# Altium project FMC_ADC_100M_10B_16CHA_TDC.PrjPCB (part 3 of 5)

## Sheet power_supply.SchDoc: FMC_ADC
size 420 x 297 mm; Author: G.Kasprowicz; CompanyName: WUT ISE; DrawnBy: G.Kasprowicz; Organization: WUT ISE; Address1: PW ISE; Address2: Nowowiejska 15/19 00-665 Warsaw; Address3: gkasprow@gmail.com; Revision: 2; SheetNumber: -; SheetTotal: -; ModifiedBy: -; CheckedDate: -; Title2: Power supply; DivGrp: WUT ISE; Designer: G.Kasprowicz; ModifiedDate: -; ProjectName: Sensor Box
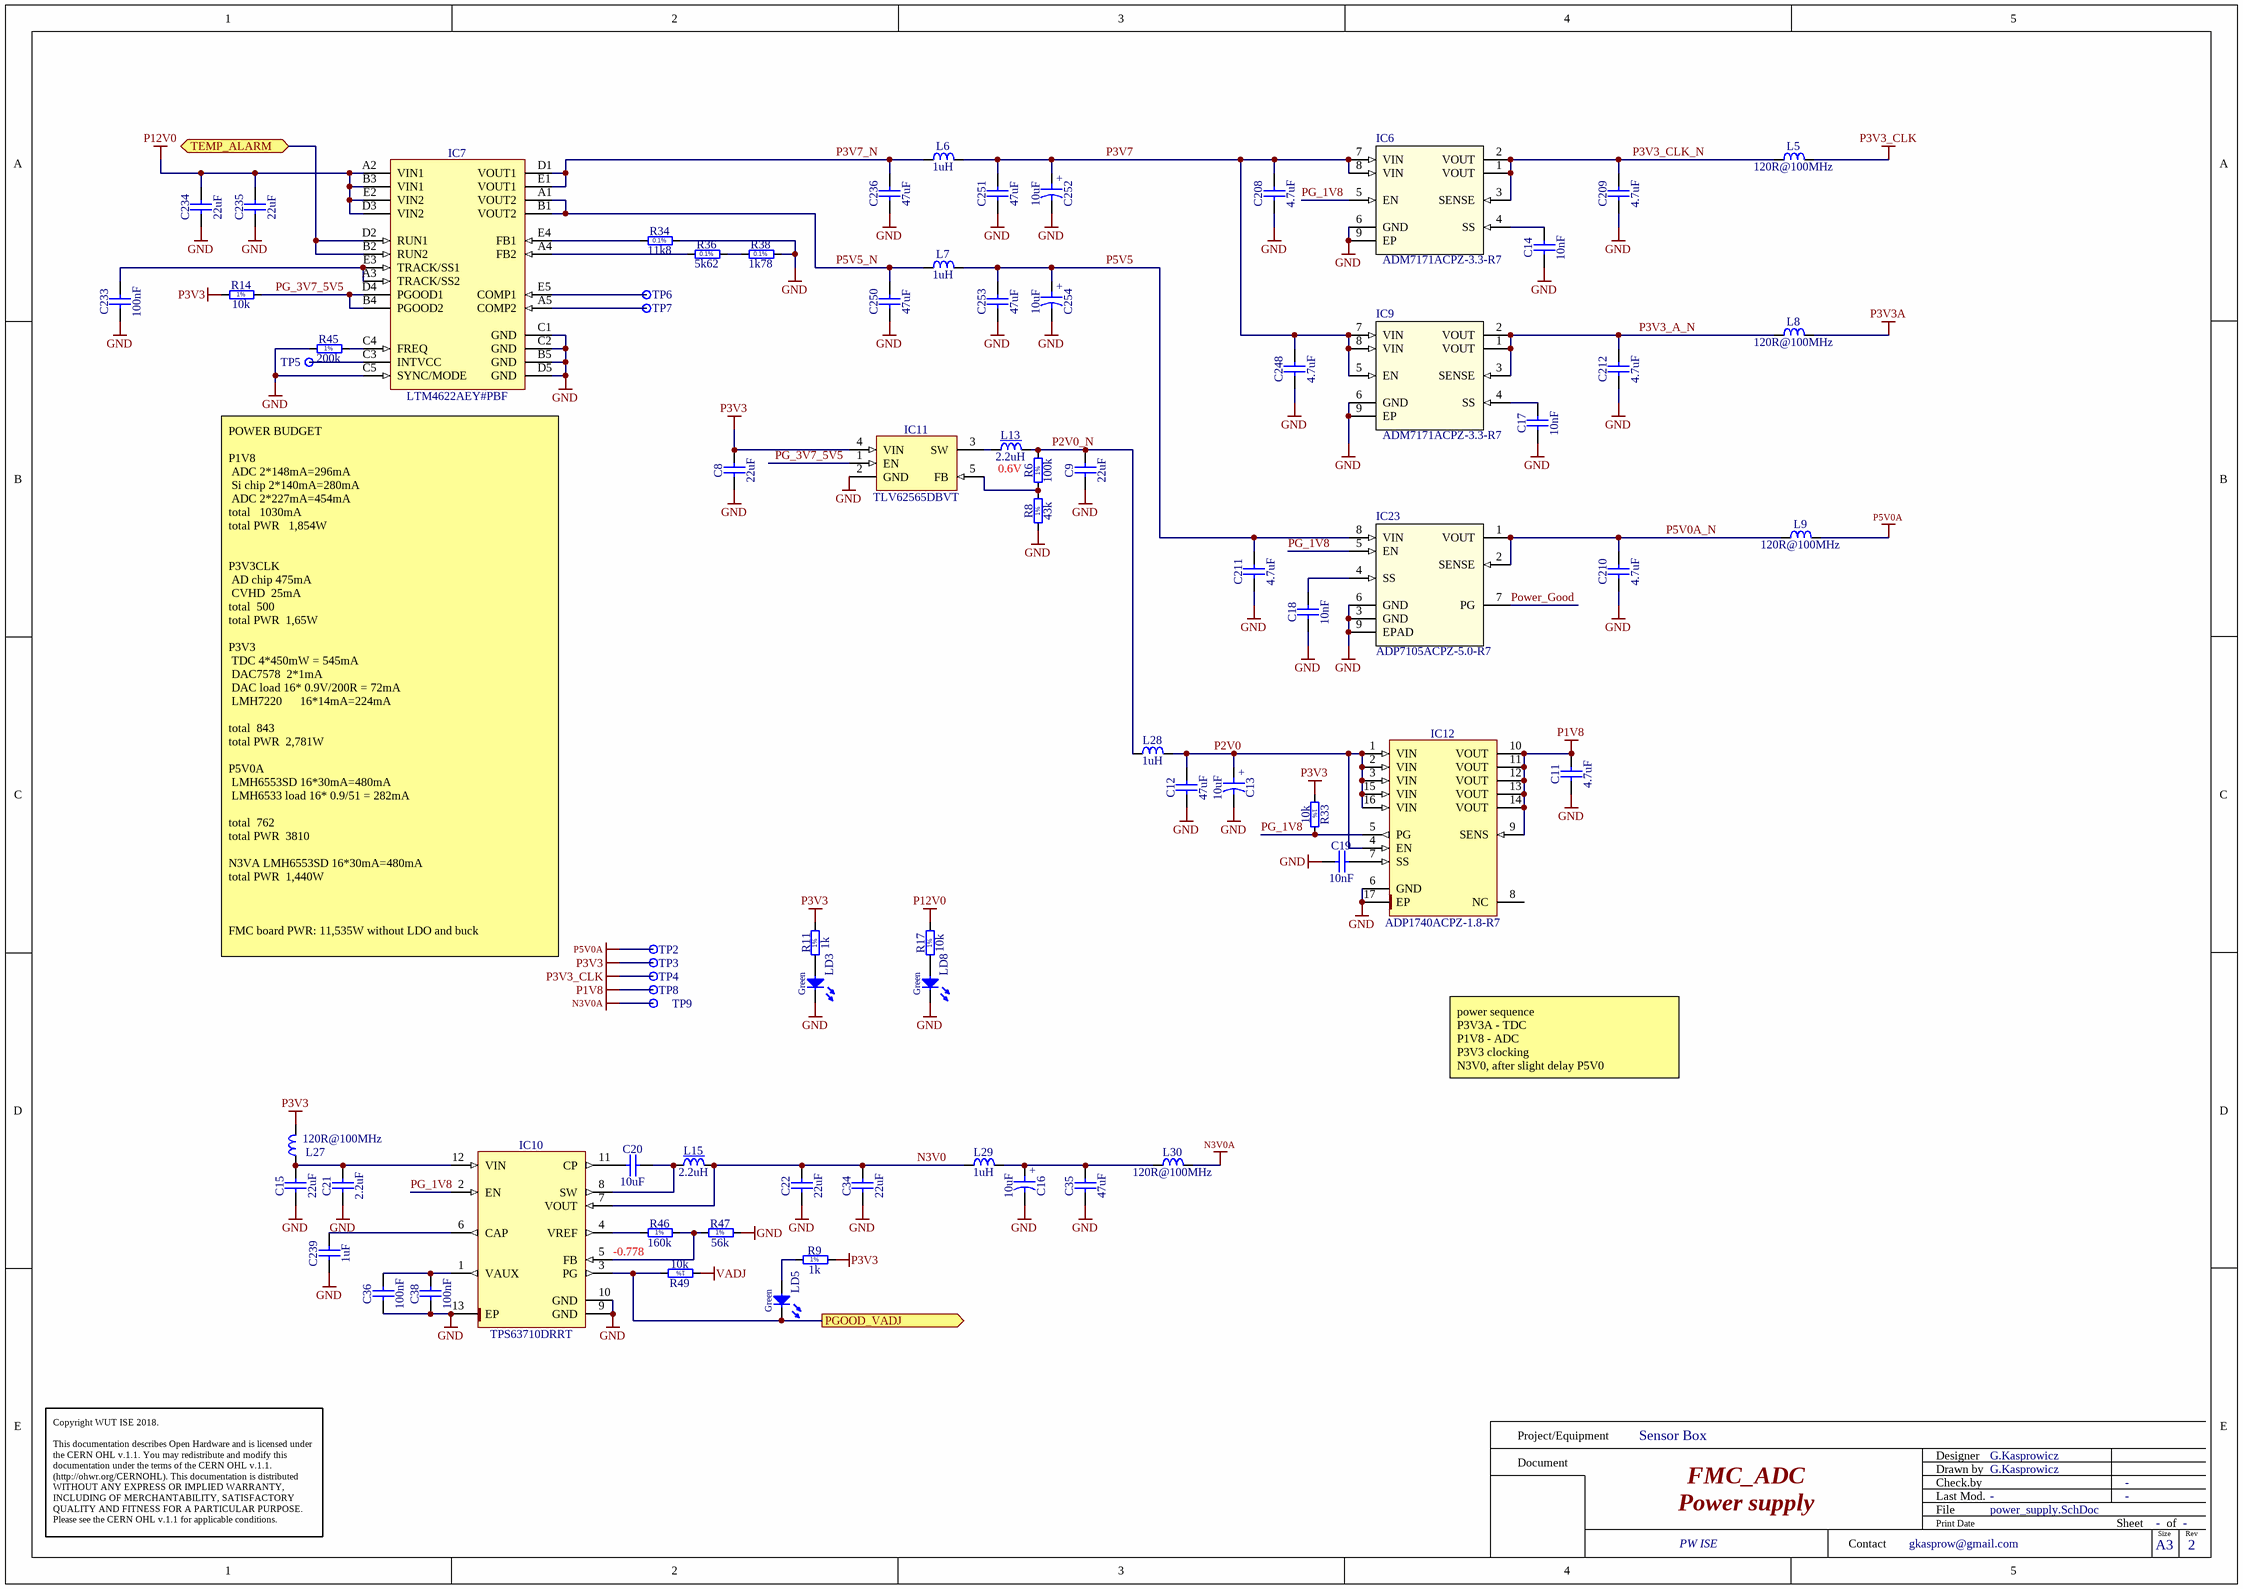
[diagram p6: power_supply.SchDoc]

### Parts
C8  22uF  [CAPC2012X135N]
C9  22uF  [CAPC2012X135N]
C11  4.7uF  [CAPC1709X95N]
C12  47uF  [CAPC3225X270N]
C13  10uF  [CAPMP3216X180N]
C14  10nF  [CAPC1005X55N]
C15  22uF  [CAPC2012X135N]
C16  10uF  [CAPMP3216X180N]
C17  10nF  [CAPC1005X55N]
C18  10nF  [CAPC1005X55N]
C19  10nF  [CAPC1005X55N]
C20  10uF  [CAPC2012X135N]
C21  2.2uF  [CAPC1608X87N]
C22  22uF  [CAPC2012X135N]
C34  22uF  [CAPC2012X135N]
C35  47uF  [CAPC3225X270N]
C36  100nF  [CAPC1005X55N]
C38  100nF  [CAPC1005X55N]
C208  4.7uF  [CAPC1709X95N]
C209  4.7uF  [CAPC1709X95N]
C210  4.7uF  [CAPC1709X95N]
C211  4.7uF  [CAPC1709X95N]
C212  4.7uF  [CAPC1709X95N]
C233  100nF  [CAPC1005X55N]
C234  22uF  [CAPC2012X135N]
C235  22uF  [CAPC2012X135N]
C236  47uF  [CAPC3225X270N]
C239  1uF  [CAPC1608X87N]
C248  4.7uF  [CAPC1709X95N]
C250  47uF  [CAPC3225X270N]
C251  47uF  [CAPC3225X270N]
C252  10uF  [CAPMP3216X180N]
C253  47uF  [CAPC3225X270N]
C254  10uF  [CAPMP3216X180N]
IC6  ADM7171ACPZ-3.3-R7  [CP_8_21-L]
IC7  LTM4622AEY#PBF  [BGA25C127P5X5_625X625X262]
IC9  ADM7171ACPZ-3.3-R7  [CP_8_21-L]
IC10  TPS63710DRRT  [SON50P300X80_HS-13N]
IC11  TLV62565DBVT  [SOT95P280X145-5N]
IC12  ADP1740ACPZ-1.8-R7  [QFN65P400X400X100-17N-S225]
IC23  ADP7105ACPZ-5.0-R7  [CP_8_5]
L5  120R@100MHz  [INDC1608X65N]
L6  1uH  [INDC2620X100N]
L7  1uH  [INDC2620X100N]
L8  120R@100MHz  [INDC1608X65N]
L9  120R@100MHz  [INDC1608X65N]
L13  2.2uH  [IND_WURTH_WE-TPC_4828]
L15  2.2uH  [IND_WURTH_WE-TPC_4828]
L27  120R@100MHz  [INDC1608X65N]
L28  1uH  [INDC2620X100N]
L29  1uH  [INDC2620X100N]
L30  120R@100MHz  [INDC1608X65N]
LD3  Green  [LED_KINGBRIGHT_KPH-1608CGCK]
LD5  Green  [LED_KINGBRIGHT_KPH-1608CGCK]
LD8  Green  [LED_KINGBRIGHT_KPH-1608CGCK]
R6  100k  [RESC1005X40N]
R8  43k  [RESC1005X40N]
R9  1k  [RESC1005X40N]
R11  1k  [RESC1005X40N]
R14  10k  [RESC1005X40N]
R17  10k  [RESC1005X40N]
R33  10k  [RESC1005X40N]
R34  11k8  [RESC1608X55N]
R36  5k62  [RESC1608X55N]
R38  1k78  [RESC1608X55N]
R45  200k  [RESC1005X40N]
R46  160k  [RESC1005X40N]
R47  56k  [RESC1005X40N]
R49  10k  [RESC1005X40N]
TP2  Test Point  [TPS62]  (value not drawn)
TP3  Test Point  [TPS62]  (value not drawn)
TP4  Test Point  [TPS62]  (value not drawn)
TP5  Test Point  [TPS62]  (value not drawn)
TP6  Test Point  [TPS62]  (value not drawn)
TP7  Test Point  [TPS62]  (value not drawn)
TP8  Test Point  [TPS62]  (value not drawn)
TP9  Test Point  [TPS62]  (value not drawn)

### Ports
PGOOD_VADJ (out), TEMP_ALARM (bidir)

### Nets
GND: C8.1 C9.1 C11.1 C12.1 C13.2 C14.1 C15.1 C16.2 C17.1 C18.1 C19.1 C21.1 C22.1 C34.1 C35.1 C36.1 C38.1 C208.1 C209.1 C210.1 C211.1 C212.1 C233.1 C234.1 C235.1 C236.1 C239.1 C248.1 C250.1 C251.1 C252.2 C253.1 C254.2 IC6.6(GND) IC6.9(EP) IC7.B5(GND) IC7.C1(GND) IC7.C2(GND) IC7.C5(SYNC/MODE) IC7.D5(GND) IC9.6(GND) IC9.9(EP) IC10.9(GND) IC10.10(GND) IC10.13(EP) IC11.2(GND) IC12.6(GND) IC12.17(EP) IC23.3(GND) IC23.6(GND) IC23.9(EPAD) LD3.1(C) LD8.1(C) R8.1 R34.2 R38.2 R45.1 R47.2
N3V0A: L30.2 TP9.1
P1V8: C11.2 IC12.9(SENS) IC12.10(VOUT) IC12.11(VOUT) IC12.12(VOUT) IC12.13(VOUT) IC12.14(VOUT) TP8.1
P3V3: C8.2 IC11.4(VIN) L27.2 R9.2 R11.2 R14.1 R33.1 TP3.1
P3V3_CLK: L5.2 TP4.1
P3V3A: L8.2  [project net DVDD33]
P5V0A: L9.2 TP2.1
P12V0: C234.2 C235.2 IC7.A2(VIN1) IC7.B3(VIN1) IC7.D3(VIN2) IC7.E2(VIN2) R17.2
VADJ: R49.1
LA29_N: IC10.3(PG) LD5.1(C) R49.2 ; port PGOOD_VADJ
N3V0: C22.2 C34.2 IC10.7(VOUT) L15.2 L29.1
P2V0: C12.2 C13.1 IC12.1(VIN) IC12.2(VIN) IC12.3(VIN) IC12.4(EN) IC12.15(VIN) IC12.16(VIN) L28.2
P2V0_N: C9.2 L13.2 L28.1 R6.2
P3V3_A_N: C212.2 IC9.1(VOUT) IC9.2(VOUT) IC9.3(SENSE) L8.1
P3V3_CLK_N: C209.2 IC6.1(VOUT) IC6.2(VOUT) IC6.3(SENSE) L5.1
P3V7: C208.2 C248.2 C251.2 C252.1 IC6.7(VIN) IC6.8(VIN) IC9.5(EN) IC9.7(VIN) IC9.8(VIN) L6.2
P3V7_N: C236.2 IC7.D1(VOUT1) IC7.E1(VOUT1) L6.1
P5V0A_N: C210.2 IC23.1(VOUT) IC23.2(SENSE) L9.1
P5V5: C211.2 C253.2 C254.1 IC23.8(VIN) L7.2
P5V5_N: C250.2 IC7.A1(VOUT2) IC7.B1(VOUT2) L7.1
PG_1V8: IC6.5(EN) IC10.2(EN) IC12.5(PG) IC23.5(EN) R33.2
PG_3V7_5V5: IC7.B4(PGOOD2) IC7.D4(PGOOD1) IC11.1(EN) R14.2
Power_Good: IC23.7(PG)
TEMP_ALARM: IC7.B2(RUN2) IC7.D2(RUN1) ; port TEMP_ALARM
NetC14_2: C14.2 IC6.4(SS)
NetC15_2: C15.2 C21.2 IC10.12(VIN) L27.1
NetC16_1: C16.1 C35.2 L29.2 L30.1
NetC17_2: C17.2 IC9.4(SS)
NetC18_2: C18.2 IC23.4(SS)
NetC19_2: C19.2 IC12.7(SS)
NetC20_1: C20.1 IC10.11(CP)
NetC20_2: C20.2 IC10.8(SW) L15.1
NetC36_2: C36.2 C38.2 IC10.1(VAUX)
NetC233_2: C233.2 IC7.A3(TRACK/SS2) IC7.E3(TRACK/SS1)
NetC239_2: C239.2 IC10.6(CAP)
NetIC7_A4: IC7.A4(FB2) R36.1
NetIC7_A5: IC7.A5(COMP2) TP7.1
NetIC7_C3: IC7.C3(INTVCC) TP5.1
NetIC7_C4: IC7.C4(FREQ) R45.2
NetIC7_E4: IC7.E4(FB1) R34.1
NetIC7_E5: IC7.E5(COMP1) TP6.1
NetIC10_4: IC10.4(VREF) R46.1
NetIC10_5: IC10.5(FB) R46.2 R47.1
NetIC11_3: IC11.3(SW) L13.1
NetIC11_5: IC11.5(FB) R6.1 R8.2
NetLD3_2: LD3.2(A) R11.1
NetLD5_2: LD5.2(A) R9.1
NetLD8_2: LD8.2(A) R17.1
NetR36_2: R36.2 R38.1

Not connected (* = marked no-connect by the designer): IC12 8(NC)

### Notes on the sheet
- 0.6V
- POWER BUDGET
  P1V8
  ADC	2*148mA=296mA
  Si chip	2*140mA=280mA
  ADC	2*227mA=454mA
  total			1030mA
  total PWR			1,854W
  P3V3CLK
  AD chip	475mA
  CVHD 	25mA
  total		500
  total PWR		1,65W
  P3V3
  TDC	4*450mW = 545mA
  DAC7578	 2*1mA
  DAC load	16* 0.9V/200R = 72mA
  LMH7220	     16*14mA=224mA
  total		843
  total PWR		2,781W
  P5V0A
  LMH6553SD 16*30mA=480mA
  LMH6533 load 16* 0.9/51 = 282mA
  total		762
  total PWR		3810
  N3VA	LMH6553SD 16*30mA=480mA
  total PWR		1,440W
  FMC board PWR: 11,535W without LDO and buck
- power sequence
  P3V3A - TDC
  P1V8 - ADC
  P3V3 clocking
  N3V0, after slight delay P5V0
- -0.778
- Project/Equipment
- Document
- Designer
- Drawn by
- Check.by
- Copyright WUT ISE 2018.
  This documentation describes Open Hardware and is licensed under the CERN OHL v.1.1. You may redistribute and modify this documentation under the terms of the CERN OHL v.1.1. (http://ohwr.org/CERNOHL). This documentation is distributed WITHOUT ANY EXPRESS OR IMPLIED WARRANTY, INCLUDING OF MERCHANTABILITY, SATISFACTORY QUALITY AND FITNESS FOR A PARTICULAR PURPOSE. Please see the CERN OHL v.1.1 for applicable conditions.
- Contact
- File
- Last Mod.
- Print Date
- Sheet
- Size
- A3
- of
- Rev
- (in symbol CTE3216-18_10UF_10V_10%_LESR1800) +
- (in symbol R0402_1K_1%_0.0625W_100PPM) 1%
- (in symbol R0402_10K_1%_0.0625W_100PPM) 1%
- (in symbol R0402_43K_1%_0.0625W_100PPM) 1%
- (in symbol R0402_56K_1%_0.0625W_100PPM) 1%
- (in symbol R0402_100K_1%_0.0625W_100PPM) 1%
- (in symbol R0402_160K_1%_0.0625W_100PPM) 1%
- (in symbol R0402_200K_1%_0.0625W_100PPM) 1%
- (in symbol R0603_1K78_0.1%_0.063W_10PPM) 0.1%
- (in symbol R0603_5K62_0.1%_0.063W_10PPM) 0.1%
- (in symbol R0603_11K8_0.1%_0.063W_10PPM) 0.1%

### Library data of the parts
C8 C9 C15 C22 C34 C234 C235 = CC0805_22UF_16V_10%_X5R: Non-polarised capacitor; Part Description: SMD Multilayer Chip Ceramic Capacitor; Manufacturer: GENERIC; Manufacturer1 Part Number: C2012X5R1C226KT; Voltage: 16V; TC: X5R; Tolerance: ±10%; Part Number: CC0805_22UF_16V_10%_X5R; Component Kind: Standard; Component Type: Standard; Pin Count: 2; Value: 22uF; Status: Preferred; Manufacturer Part Number: CC0805_22UF_16V_10%_X5R; Case: 0805; Mounted: Yes; Socket: No; SMD: Yes; Sense: No; Manufacturer1 Example: TDK; Manufacturer1 ComponentHeight: 1.35mm; HelpURL: \\cern.ch\dfs\Applications\Altium\Datasheets\CC0805_X5R_TDK_C.pdf; Author: CERN DEM JLC; CreateDate: 25.10.2012; LatestRevisionDate: 25.10.2012
C11 C208-C212 C248 = CC0603_4.7UF_16V_10%_X5R: Non-polarised capacitor; Part Description: SMD Multilayer Chip Ceramic Capacitor; Manufacturer: GENERIC; Manufacturer1 Part Number: EMK107ABJ475KA-T; Voltage: 16V; TC: X5R; Tolerance: ±10%; Part Number: CC0603_4.7UF_16V_10%_X5R; Component Kind: Standard; Component Type: Standard; Pin Count: 2; Value: 4.7uF; Status: None; Manufacturer Part Number: CC0603_4.7UF_16V_10%_X5R; Case: 0603; Mounted: Yes; Socket: No; SMD: Yes; Sense: No; Manufacturer1 Example: TAIYO YUDEN; Manufacturer1 ComponentHeight: 0.95mm; HelpURL: \\cern.ch\dfs\Applications\Altium\Datasheets\CC0603_X7R_TAIYO-YUDEN_HIGH-VALUE.pdf; Author: CERN DEM JLC; CreateDate: 16.12.2013; LatestRevisionDate: 16.09.2014
C12 C35 C236 C250 C251 C253 = CC1210_47UF_10V_20%_X5R: Non-polarised capacitor; Part Description: SMD Multilayer Chip Ceramic Capacitor; Manufacturer: GENERIC; Manufacturer1 Part Number: LMK325BJ476MM-T; Voltage: 10V; TC: X5R; Tolerance: ±20%; Part Number: CC1210_47UF_10V_20%_X5R; Component Kind: Standard; Component Type: Standard; Pin Count: 2; Value: 47uF; Status: None; Manufacturer Part Number: CC1210_47UF_10V_20%_X5R; Case: 1210; Mounted: Yes; Socket: No; SMD: Yes; Sense: No; Manufacturer1 Example: TAIYO YUDEN; Manufacturer1 ComponentHeight: 2.7mm; HelpURL: \\cern.ch\dfs\Applications\Altium\Datasheets\CC1210_X5R_TAIYO-YUDEN_HIGH-VALUE.pdf; Author: CERN DEM JLC; CreateDate: 04.05.2011; LatestRevisionDate: 04.05.2011
C13 C16 C252 C254 = CTE3216-18_10UF_10V_10%_LESR1800: Polarised capacitor; Part Description: Low ESR 1R8 Solid Tantalum Chip Capacitor; Manufacturer: GENERIC; Manufacturer1 Part Number: TPSA106K010R1800; Voltage: 10V; Tolerance: ±10%; Part Number: CTE3216-18_10UF_10V_10%_LESR1800; Component Kind: Standard; Component Type: Standard; Pin Count: 2; Value: 10uF; Status: Preferred; Manufacturer Part Number: CTE3216-18_10UF_10V_10%_LESR1800; Case: A; Mounted: Yes; Socket: No; SMD: Yes; Sense: No; Manufacturer1 Example: AVX; Manufacturer1 ComponentHeight: 1.8mm; HelpURL: \\cern.ch\dfs\Applications\Altium\Datasheets\CTE-LESR_AVX_TPS.pdf; Author: CERN DEM JLC; CreateDate: 05.05.2008; LatestRevisionDate: 20.01.2009
C14 C17-C19 = CC0402_10NF_16V_10%_X7R: Non-polarised capacitor; Part Description: SMD Multilayer Chip Ceramic Capacitor; Manufacturer: GENERIC; Manufacturer1 Part Number: 223878715636; Voltage: 16V; TC: X7R; Tolerance: ±10%; Part Number: CC0402_10NF_16V_10%_X7R; Component Kind: Standard; Component Type: Standard; Pin Count: 2; Value: 10nF; Status: Not Recommended; Manufacturer Part Number: CC0402_10NF_16V_10%_X7R; Case: 0402; Mounted: Yes; Socket: No; SMD: Yes; Sense: No; Manufacturer1 Example: PHYCOMP; Manufacturer1 ComponentHeight: 0.55mm; HelpURL: \\cern.ch\dfs\Applications\Altium\Datasheets\CC0402_X7R_PHYCOMP.pdf; Author: CERN DEM JLC; CreateDate: 03.12.2007; LatestRevisionDate: 03.12.2007
C20 = CC0805_10UF_16V_10%_X5R: Non-polarised capacitor; Part Description: SMD Multilayer Chip Ceramic Capacitor; Manufacturer: GENERIC; Manufacturer1 Part Number: C0805C106K4PAC; Voltage: 16V; TC: X5R; Tolerance: ±10%; Part Number: CC0805_10UF_16V_10%_X5R; Component Kind: Standard; Component Type: Standard; Pin Count: 2; Value: 10uF; Status: Preferred; Manufacturer Part Number: CC0805_10UF_16V_10%_X5R; Case: 0805; Mounted: Yes; Socket: No; SMD: Yes; Sense: No; Manufacturer1 Example: KEMET; Manufacturer1 ComponentHeight: 1.4mm; HelpURL: \\cern.ch\dfs\Applications\Altium\Datasheets\CC1206_X5R_KEMET.pdf; Author: CERN DEM JLC; CreateDate: 03.12.2007; LatestRevisionDate: 03.12.2007
C21 = CC0603_2.2UF_16V_10%_X5R: Non-polarised capacitor; Part Description: SMD Multilayer Chip Ceramic Capacitor; Manufacturer: GENERIC; Manufacturer1 Part Number: CC0603KRX5R7BB225; Voltage: 16V; TC: X5R; Tolerance: ±10%; Part Number: CC0603_2.2UF_16V_10%_X5R; Component Kind: Standard; Component Type: Standard; Pin Count: 2; Value: 2.2uF; Status: Preferred; Manufacturer Part Number: CC0603_2.2UF_16V_10%_X5R; Case: 0603; Mounted: Yes; Socket: No; SMD: Yes; Sense: No; Manufacturer1 Example: YAGEO; Manufacturer1 ComponentHeight: 0.9mm; HelpURL: \\cern.ch\dfs\Applications\Altium\Datasheets\CC0805_X5R_PHYCOMP_HC.pdf; Author: CERN DEM JLC; CreateDate: 28.04.2011; LatestRevisionDate: 28.04.2011
C36 C38 C233 = CC0402_100NF_16V_10%_X5R: Non-polarised capacitor; Part Description: SMD Multilayer Chip Ceramic Capacitor; Manufacturer: GENERIC; Manufacturer1 Part Number: GRM155R61C104KA88D; Voltage: 16V; TC: X5R; Tolerance: ±10%; Part Number: CC0402_100NF_16V_10%_X5R; Component Kind: Standard; Component Type: Standard; Pin Count: 2; Value: 100nF; Status: None; Manufacturer Part Number: CC0402_100NF_16V_10%_X5R; Case: 0402; Mounted: Yes; Socket: No; SMD: Yes; Sense: No; Manufacturer1 Example: MURATA; Manufacturer1 ComponentHeight: 0.55mm; HelpURL: \\cern.ch\dfs\Applications\Altium\Datasheets\CC0402_X5R_MURATA_GRM.pdf; Author: CERN DEM JLC; CreateDate: 10.12.2013; LatestRevisionDate: 10.12.2013
C239 = CC0603_1UF_16V_10%_X7R: Non-polarised capacitor; Part Description: SMD Multilayer Chip Ceramic Capacitor; Manufacturer: GENERIC; Manufacturer1 Part Number: 223878615663; Voltage: 16V; TC: X7R; Tolerance: ±10%; Part Number: CC0603_1UF_16V_10%_X7R; Component Kind: Standard; Component Type: Standard; Pin Count: 2; Value: 1uF; Status: None; Manufacturer Part Number: CC0603_1uF_16V_10%_X7R; Case: 0603; Mounted: Yes; Socket: No; SMD: Yes; Sense: No; Manufacturer1 Example: YAGEO PHYCOMP; Manufacturer1 ComponentHeight: 0.9mm; HelpURL: \\cern.ch\dfs\Applications\Altium\Datasheets\CC0603_X7R_PHYCOMP.pdf; Author: CERN DEM JLC; CreateDate: 03.12.2007; LatestRevisionDate: 17.04.2015
IC6 IC9 = ADM7171ACPZ-3.3-R7: 6.5 V, 1 A, Ultralow Noise, High PSRR,  Fast Transient Response CMOS LDO; Manufacturer: Analog Devices; Value: Value; Type: Type; Manufacturer Part Number: ADM7171ACPZ-3.3-R7
IC7 = LTM4622AEY#PBF: 3.6V-20V To 1.5V-12V, Dual 2A or Single 4A  Ultrathin Step-Down DC/DC µModule Regulator; Part Description: 3.6V-20V To 1.5V-12V, Dual 2A or Single 4A  Ultrathin Step-Down DC/DC uModule Regulator; Manufacturer: LINEAR TECHNOLOGY; PressFit: No; Bonding: No; Part Number: LTM4622AEY#PBF; Component Kind: Standard; Component Type: Standard; Device: LTM4622AEY#PBF; PackageDescription: BGA, 1.27mm Pitch, Square; 25 Pin, 5 Columns X 5 Rows, 6.25mm X 6.25mm X 2.62mm H; Manufacturer Part Number: LTM4622AEY#PBF; Pin Count: 25; Case: BGA25; Mounted: Yes; Socket: No; SMD: Yes; Sense: No; ComponentHeight: 2.62mm; HelpURL: \\cern.ch\dfs\Applications\Altium\Datasheets\LTM4622AEY#PBF.pdf; Author: CERN DEM MR; CreateDate: 29.09.2017; LatestRevisionDate: 29.09.2017
IC10 = PM_TPS6371: Low Noise, 1A Synchronous Inverting Buck Converter in 3x3 WSON Package; Manufacturer: TEXAS INSTRUMENTS; PressFit: No; Bonding: No; Part Number: TPS63710DRRT; Component Kind: Standard; Component Type: Standard; Device: TPS63710DRRT; PackageDescription: SON, 12-Leads, Body 3,00x3,00mm, Pitch 0,50mm, Thermal Pad 2,50x1,49mm, IPC Medium Density; Part Description: Low Noise, 1A Synchronous Inverting Buck Converter in 3x3 WSON Package; Manufacturer Part Number: TPS63710DRRT; Pin Count: 13; Case: SON12; Mounted: Yes; Socket: No; SMD: Yes; Sense: No; ComponentHeight: 1mm; HelpURL: \\cern.ch\dfs\Applications\Altium\Datasheets\TPS62130RGT.pdf; Author: GK; CreateDate: 02.03.2016; LatestRevisionDate: 02.03.2016
IC11 = TLV62565DBVT: 1.5A High Efficiency Step-Down Converter, Adjustable Output Voltage; Manufacturer: TEXAS INSTRUMENTS; PressFit: No; Bonding: No; Part Number: TLV62565DBVT; Component Kind: Standard; Component Type: Standard; Device: TLV62565DBVT; PackageDescription: SOT, 0.95mm Pitch; 5 Pin, 1.60mm W X 2.90mm L X 1.45mm H Body, IPC Medium Density; Part Description: 1.5A High Efficiency Step-Down Converter, Adjustable Output Voltage; Manufacturer Part Number: TLV62565DBVT; Pin Count: 5; Case: SOT23-5; Mounted: Yes; Socket: No; SMD: Yes; Sense: No; ComponentHeight: 1.45mm; HelpURL: \\cern.ch\dfs\Applications\Altium\Datasheets\TLV62565DBVT.pdf; Author: CERN DEM JMW; CreateDate: 29.08.2016; LatestRevisionDate: 29.08.2016
IC12 = ADP1740ACPZ-1.8-R7: 2A, Low-Dropout Linear Regulator; Part Description: 1.8V, 2A, Low-Dropout Linear Regulator; Manufacturer: ANALOG DEVICES; PressFit: No; Bonding: No; Part Number: ADP1740ACPZ-1.8-R7; Component Kind: Standard; Component Type: Standard; Device: ADP1740ACPZ-1.8-R7; PackageDescription: QFN, 0.65mm pitch,square; 4 pin X 4 pin, 4mm X 4mm X 1mm H body (w/thermal tab 2.25 X 2.25mm),  IPC Medium Density; Manufacturer Part Number: ADP1740ACPZ-1.8-R7; Pin Count: 17; Case: QFN16; Mounted: Yes; Socket: No; SMD: Yes; Sense: No; ComponentHeight: 1mm; HelpURL: \\cern.ch\dfs\Applications\Altium\Datasheets\ADP1740ACPZ-1.8-R7.pdf; Author: CERN DEM JLC; CreateDate: 05.02.2013; LatestRevisionDate: 05.02.2013
IC23 = ADP7105ACPZ-5.0-R7: 20 V, 500 mA, Low Noise LDO Regulator  with Soft Start; Manufacturer: Analog Devices; Value: Value; Type: Type; Manufacturer Part Number: ADP7105ACPZ-5.0-R7
L5 L8 L9 L27 L30 = IND0603_MURATA_BLM18SG121TN1D: Inductor; Part Description: SMD EMIFIL Suppression Chip Ferrite Bead; Manufacturer: MURATA; Power: 3A; Resistance: 0.025R; Tolerance: ±25%; Part Number: IND0603_MURATA_BLM18SG121TN1D; Component Kind: Standard; Component Type: Standard; Pin Count: 2; Value: 120R@100MHz; Status: None; Manufacturer Part Number: BLM18SG121TN1D; Case: 0603; Mounted: Yes; Socket: No; SMD: Yes; Sense: No; ComponentHeight: 0.65mm; HelpURL: \\cern.ch\dfs\Applications\Altium\Datasheets\IND0603_MURATA_BLM18S.pdf; Author: CERN DEM JLC; CreateDate: 23.07.2014; LatestRevisionDate: 23.07.2014
L6 L7 L28 L29 = IND1008_1UH_20%_WURTH_74479787210B: Inductor; Part Description: Power Multilayer Inductor (WE-PMI Series); Manufacturer: WURTH ELEKTRONIK; Power: 1.95A; Resistance: 0.06R; Tolerance: ±20%; Part Number: IND1008_1UH_20%_WURTH_74479787210B; Component Kind: Standard; Component Type: Standard; Pin Count: 2; Value: 1uH; Status: None; Manufacturer Part Number: 74479787210B; Mounted: Yes; Socket: No; SMD: Yes; Sense: No; ComponentHeight: 1mm; HelpURL: \\cern.ch\dfs\Applications\Altium\Datasheets\IND_WURTH_WE-PMI_74479787210B.pdf; Author: CERN DEM JLC; CreateDate: 01.10.2014; LatestRevisionDate: 01.10.2014; Case: 1008
L13 L15 = IND_2.2UH_30%_WURTH_WE-TPC_7440430022: Inductor With Core; Part Description: Shielded Tiny Power Inductor (WE-TPC Series); Manufacturer: WURTH ELEKTRONIK; Power: 2.5A; Resistance: 0.023R; Tolerance: ±30%; Part Number: IND_2.2UH_30%_WURTH_WE-TPC_7440430022; Component Kind: Standard; Component Type: Standard; Pin Count: 2; Value: 2.2uH; Status: None; Manufacturer Part Number: 7440430022; Mounted: Yes; Socket: No; SMD: Yes; Sense: No; ComponentHeight: 3mm; HelpURL: \\cern.ch\dfs\Applications\Altium\Datasheets\IND_WURTH_WE-TPC_7440430022.pdf; Author: CERN DEM JLC; CreateDate: 19.11.2012; LatestRevisionDate: 19.11.2012
LD3 LD5 LD8 = LED_KINGBRIGHT_KPH-1608CGCK: LED Green 1C 2A; Part Description: SMD Green LED, Case 1.6mmX0.8mm(0603), 0.65mm Thickness; PressFit: No; Bonding: No; Part Number: LED_KINGBRIGHT_KPH-1608CGCK; Component Kind: Standard; Component Type: Standard; Color: Green; PackageDescription: SMT Green LED, Case 0603, Body L 1.6 x W 0.8mm H 0.65mm; Manufacturer: KINGBRIGHT; Manufacturer Part Number: KPH-1608CGCK; Pin Count: 2; Mounted: Yes; Socket: No; SMD: Yes; Sense: No; ComponentHeight: 0.65mm; HelpURL: \\cern.ch\dfs\Applications\Altium\Datasheets\LED_KINGBRIGHT_KPH-1608CGCK.pdf; Author: CERN DEM JLC; CreateDate: 03.07.2017; LatestRevisionDate: 03.07.2017
R6 = R0402_100K_1%_0.0625W_100PPM: Resistor - 1%; Part Description: General Purpose Thick Film Chip Resistor; Manufacturer: GENERIC; Manufacturer1 Part Number: 232270671004L; TC: ±100ppm/°C; PressFit: No; Part Number: R0402_100K_1%_0.0625W_100PPM; Component Kind: Standard; Component Type: Standard; Pin Count: 2; Value: 100k; Status: Not Recommended; Power: 0.0625W; Tolerance: ±1%; Manufacturer Part Number: R0402_100K_1%_0.0625W_100PPM; Case: 0402; Mounted: Yes; Sense: No; Socket: No; SMD: Yes; Manufacturer1 Example: YAGEO PHYCOMP; Manufacturer1 ComponentHeight: 0.4mm; HelpURL: \\cern.ch\dfs\Applications\Altium\Datasheets\R0402_Phycomp_RC0402.pdf; Author: CERN DEM JLC; CreateDate: 03.12.2007; LatestRevisionDate: 17.10.2012
R8 = R0402_43K_1%_0.0625W_100PPM: Resistor - 1%; Part Description: General Purpose Thick Film Chip Resistor; Manufacturer: GENERIC; Manufacturer1 Part Number: 232270674303L; TC: ±100ppm/°C; PressFit: No; Part Number: R0402_43K_1%_0.0625W_100PPM; Component Kind: Standard; Component Type: Standard; Pin Count: 2; Value: 43k; Status: Not Recommended; Power: 0.0625W; Tolerance: ±1%; Manufacturer Part Number: R0402_43K_1%_0.0625W_100PPM; Case: 0402; Mounted: Yes; Sense: No; Socket: No; SMD: Yes; Manufacturer1 Example: YAGEO PHYCOMP; Manufacturer1 ComponentHeight: 0.4mm; HelpURL: \\cern.ch\dfs\Applications\Altium\Datasheets\R0402_Phycomp_RC0402.pdf; Author: CERN DEM JLC; CreateDate: 03.12.2007; LatestRevisionDate: 17.10.2012
R9 R11 = R0402_1K_1%_0.0625W_100PPM: Resistor - 1%; Part Description: General Purpose Thick Film Chip Resistor; Manufacturer: GENERIC; Manufacturer1 Part Number: 232270671002L; TC: ±100ppm/°C; PressFit: No; Part Number: R0402_1K_1%_0.0625W_100PPM; Component Kind: Standard; Component Type: Standard; Pin Count: 2; Value: 1k; Status: Not Recommended; Power: 0.0625W; Tolerance: ±1%; Manufacturer Part Number: R0402_1K_1%_0.0625W_100PPM; Case: 0402; Mounted: Yes; Sense: No; Socket: No; SMD: Yes; Manufacturer1 Example: YAGEO PHYCOMP; Manufacturer1 ComponentHeight: 0.4mm; HelpURL: \\cern.ch\dfs\Applications\Altium\Datasheets\R0402_Phycomp_RC0402.pdf; Author: CERN DEM JLC; CreateDate: 03.12.2007; LatestRevisionDate: 17.10.2012
R14 R17 R33 R49 = R0402_10K_1%_0.0625W_100PPM: Resistor - 1%; Part Description: General Purpose Thick Film Chip Resistor; Manufacturer: GENERIC; Manufacturer1 Part Number: 232270671003L; TC: ±100ppm/°C; PressFit: No; Part Number: R0402_10K_1%_0.0625W_100PPM; Component Kind: Standard; Component Type: Standard; Pin Count: 2; Value: 10k; Status: Not Recommended; Power: 0.0625W; Tolerance: ±1%; Manufacturer Part Number: R0402_10K_1%_0.0625W_100PPM; Case: 0402; Mounted: Yes; Sense: No; Socket: No; SMD: Yes; Manufacturer1 Example: YAGEO PHYCOMP; Manufacturer1 ComponentHeight: 0.4mm; HelpURL: \\cern.ch\dfs\Applications\Altium\Datasheets\R0402_Phycomp_RC0402.pdf; Author: CERN DEM JLC; CreateDate: 03.12.2007; LatestRevisionDate: 17.10.2012
R34 = R0603_11K8_0.1%_0.063W_10PPM: Resistor - 0.1%; Part Description: Thin Film Chip Resistor; Manufacturer: GENERIC; Manufacturer1 Part Number: RN73C1J11K8BTDF; Power: 0.063W; TC: ±10ppm; Part Number: R0603_11K8_0.1%_0.063W_10PPM; Component Kind: Standard; Component Type: Standard; Pin Count: 2; Value: 11k8; Status: Not recommended; Tolerance: ±0.1%; Manufacturer Part Number: R0603_11K8_0.1%_0.063W_10PPM; Case: 0603; Mounted: Yes; Sense: No; Socket: No; SMD: Yes; Manufacturer1 Example: TYCO HOLSWORTHY; Manufacturer1 ComponentHeight: 0.5mm; HelpURL: \\cern.ch\dfs\Applications\Altium\Datasheets\R0603_Tyco_RN73.pdf; Author: CERN DEM JLC; CreateDate: 03.12.2007; LatestRevisionDate: 13.03.2008
R36 = R0603_5K62_0.1%_0.063W_10PPM: Resistor - 0.1%; Part Description: Thin Film Chip Resistor; Manufacturer: GENERIC; Manufacturer1 Part Number: RN73C1J5K62BTDF; Power: 0.063W; TC: ±10ppm; Part Number: R0603_5K62_0.1%_0.063W_10PPM; Component Kind: Standard; Component Type: Standard; Pin Count: 2; Value: 5k62; Status: Not recommended; Tolerance: ±0.1%; Manufacturer Part Number: R0603_5K62_0.1%_0.063W_10PPM; Case: 0603; Mounted: Yes; Sense: No; Socket: No; SMD: Yes; Manufacturer1 Example: TYCO HOLSWORTHY; Manufacturer1 ComponentHeight: 0.5mm; HelpURL: \\cern.ch\dfs\Applications\Altium\Datasheets\R0603_Tyco_RN73.pdf; Author: CERN DEM JLC; CreateDate: 03.12.2007; LatestRevisionDate: 13.03.2008
R38 = R0603_1K78_0.1%_0.063W_10PPM: Resistor - 0.1%; Part Description: Thin Film Chip Resistor; Manufacturer: GENERIC; Manufacturer1 Part Number: RN73C1J1K78BTDF; Power: 0.063W; TC: ±10ppm; Part Number: R0603_1K78_0.1%_0.063W_10PPM; Component Kind: Standard; Component Type: Standard; Pin Count: 2; Value: 1k78; Status: Not recommended; Tolerance: ±0.1%; Manufacturer Part Number: R0603_1K78_0.1%_0.063W_10PPM; Case: 0603; Mounted: Yes; Sense: No; Socket: No; SMD: Yes; Manufacturer1 Example: TYCO HOLSWORTHY; Manufacturer1 ComponentHeight: 0.5mm; HelpURL: \\cern.ch\dfs\Applications\Altium\Datasheets\R0603_Tyco_RN73.pdf; Author: CERN DEM JLC; CreateDate: 03.12.2007; LatestRevisionDate: 13.03.2008
R45 = R0402_200K_1%_0.0625W_100PPM: Resistor - 1%; Part Description: General Purpose Thick Film Chip Resistor; Manufacturer: GENERIC; Manufacturer1 Part Number: 232270672004L; TC: ±100ppm/°C; Part Number: R0402_200K_1%_0.0625W_100PPM; Component Kind: Standard; Component Type: Standard; Pin Count: 2; Value: 200k; Status: Not recommended; Power: 0.0625W; Tolerance: ±1%; Manufacturer Part Number: R0402_200K_1%_0.0625W_100PPM; Case: 0402; Mounted: Yes; Sense: No; Socket: No; SMD: Yes; Manufacturer1 Example: YAGEO PHYCOMP; Manufacturer1 ComponentHeight: 0.4mm; HelpURL: \\cern.ch\dfs\Applications\Altium\Datasheets\R0402_Phycomp_RC0402.pdf; Author: CERN DEM JLC; CreateDate: 03.12.2007; LatestRevisionDate: 17.10.2012
R46 = R0402_160K_1%_0.0625W_100PPM: Resistor - 1%; Part Description: General Purpose Thick Film Chip Resistor; Manufacturer: GENERIC; Manufacturer1 Part Number: 232270671604L; TC: ±100ppm/°C; PressFit: No; Part Number: R0402_160K_1%_0.0625W_100PPM; Component Kind: Standard; Component Type: Standard; Pin Count: 2; Value: 160k; Status: Not Recommended; Power: 0.0625W; Tolerance: ±1%; Manufacturer Part Number: R0402_160K_1%_0.0625W_100PPM; Case: 0402; Mounted: Yes; Sense: No; Socket: No; SMD: Yes; Manufacturer1 Example: YAGEO PHYCOMP; Manufacturer1 ComponentHeight: 0.4mm; HelpURL: \\cern.ch\dfs\Applications\Altium\Datasheets\R0402_Phycomp_RC0402.pdf; Author: CERN DEM JLC; CreateDate: 03.12.2007; LatestRevisionDate: 17.10.2012
R47 = R0402_56K_1%_0.0625W_100PPM: Resistor - 1%; Part Description: General Purpose Thick Film Chip Resistor; Manufacturer: GENERIC; Manufacturer1 Part Number: 232270675603L; TC: ±100ppm/°C; PressFit: No; Part Number: R0402_56K_1%_0.0625W_100PPM; Component Kind: Standard; Component Type: Standard; Pin Count: 2; Value: 56k; Status: Not Recommended; Power: 0.0625W; Tolerance: ±1%; Manufacturer Part Number: R0402_56K_1%_0.0625W_100PPM; Case: 0402; Mounted: Yes; Sense: No; Socket: No; SMD: Yes; Manufacturer1 Example: YAGEO PHYCOMP; Manufacturer1 ComponentHeight: 0.4mm; HelpURL: \\cern.ch\dfs\Applications\Altium\Datasheets\R0402_Phycomp_RC0402.pdf; Author: CERN DEM JLC; CreateDate: 03.12.2007; LatestRevisionDate: 17.10.2012
TP2-TP9 = SMD_PAD_0.62X0.62MM: Part Description: 0.62mm x 0.62mm PCB Copper Area (SMD Test Point); Mounted: No; Part Number: SMD_PAD_0.62X0.62MM; Component Kind: Standard (No BOM); Component Type: Standard (No BOM); Pin Count: 1; Family: Test Point; Socket: No; SMD: Yes; Sense: No; Status: None; ComponentHeight: 0mm; HelpURL: Undefined; Author: CERN DEM JLC; CreateDate: 12.01.2008; LatestRevisionDate: 12.01.2008; PackageDescription: 0.62mm x 0.62mm PCB Copper Area (SMD Test Point)

## Sheet IDX_CTRL.SchDoc: FMC_ADC
size 420 x 297 mm; Author: G.Kasprowicz; CompanyName: WUT ISE; DrawnBy: G.Kasprowicz; Organization: WUT ISE; Address1: PW ISE; Address2: Nowowiejska 15/19 00-665 Warsaw; Address3: gkasprow@gmail.com; Revision: 2; SheetNumber: -; SheetTotal: -; ModifiedBy: -; CheckedDate: -; Title2: TDC INDEX signal distribution; DivGrp: WUT ISE; Designer: G.Kasprowicz; ModifiedDate: -; ProjectName: Sensor Box
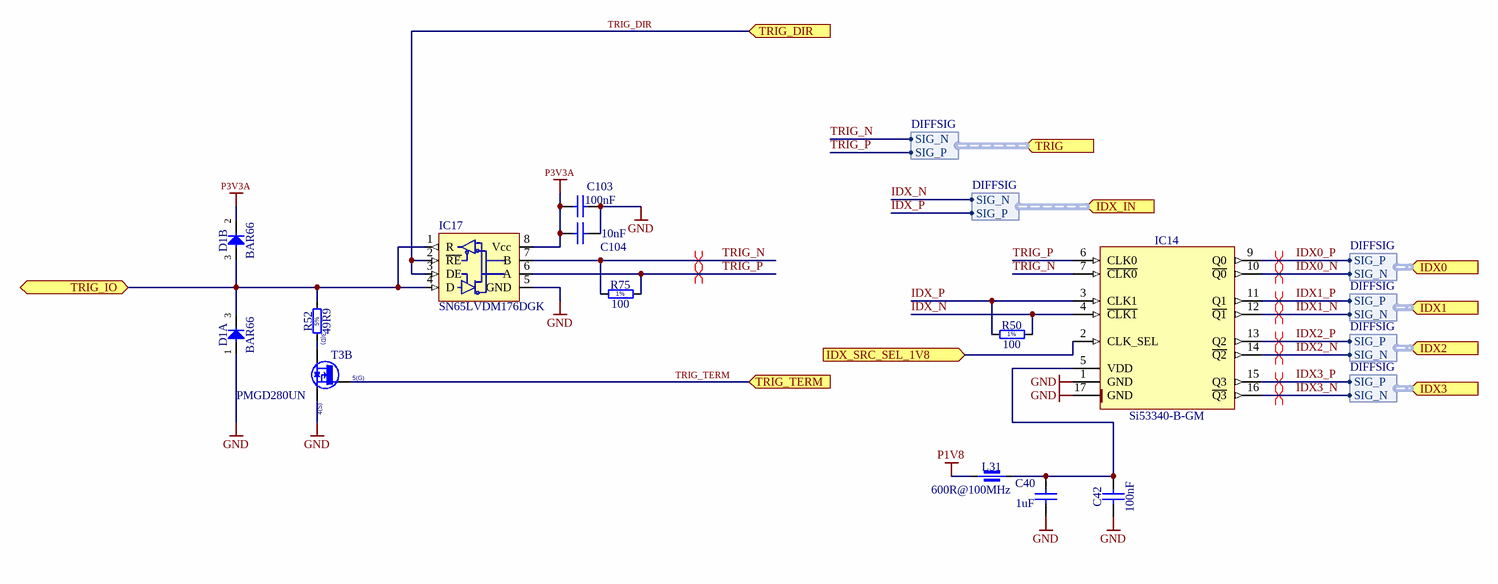
[diagram p7: IDX_CTRL.SchDoc]

### Parts
C40  1uF  [CAPC1005X55N]
C42  100nF  [CAPC0603X33N]
C103  100nF  [CAPC0603X33N]
C104  10nF  [CAPC0603X33N]
D1  BAR66  [SOT95P240X110-3N]  (parts A,B of 2)
IC14  Si53340-B-GM  [QFN50P300X300X90-17N-S175]
IC17  SN65LVDM176DGK  [MSOP8 TI/AD]
L31  600R@100MHz  [INDC1005X55N]
R50  100  [RESC0603X28N]
R52  49R9  [RESC3225X70N]
R75  100  [RESC0603X28N]
T3  PMGD280UN  [SOT65P210X110-6N]  (part B of 2)

### Ports
IDX0 (in, harness DIFFSIG), IDX1 (in, harness DIFFSIG), IDX2 (in, harness DIFFSIG), IDX3 (in, harness DIFFSIG), IDX_IN (in, harness DIFFSIG), IDX_SRC_SEL_1V8 (in), TRIG (in, harness DIFFSIG), TRIG_DIR (in), TRIG_IO (bidir), TRIG_TERM (in)

### Harnesses
DIFFSIG: SIG_N, SIG_P

### Nets
GND: C40.1 C42.1 C103.2 C104.2 D1.1(A) IC14.1(GND) IC14.17(GND) IC17.5(GND) T3.4(S)
P1V8: L31.1
P3V3A: C103.1 C104.1 D1.2(C) IC17.8(Vcc)  [project net DVDD33]
IDX0_N: IC14.10(~{Q0}) ; port IDX0.SIG_N  [project net IDX0.SIG_N]
IDX0_P: IC14.9(Q0) ; port IDX0.SIG_P  [project net IDX0.SIG_P]
IDX1_N: IC14.12(~{Q1}) ; port IDX1.SIG_N  [project net IDX1.SIG_N]
IDX1_P: IC14.11(Q1) ; port IDX1.SIG_P  [project net IDX1.SIG_P]
IDX2_N: IC14.14(~{Q2}) ; port IDX2.SIG_N  [project net IDX2.SIG_N]
IDX2_P: IC14.13(Q2) ; port IDX2.SIG_P  [project net IDX2.SIG_P]
IDX3_N: IC14.16(~{Q3}) ; port IDX3.SIG_N  [project net IDX3.SIG_N]
IDX3_P: IC14.15(Q3) ; port IDX3.SIG_P  [project net IDX3.SIG_P]
IDX_N: IC14.4(~{CLK1}) R50.2 ; port IDX_IN.SIG_N
IDX_P: IC14.3(CLK1) R50.1 ; port IDX_IN.SIG_P
IDX_SRC_SEL_1V8: IC14.2(CLK_SEL) ; port IDX_SRC_SEL_1V8
TRIG_DIR: IC17.2(~{RE}) IC17.3(DE) ; port TRIG_DIR
TRIG_N: IC14.7(~{CLK0}) IC17.7(B) R75.1 ; port TRIG.SIG_N  [project net LA16_N]
TRIG_P: IC14.6(CLK0) IC17.6(A) R75.2 ; port TRIG.SIG_P  [project net LA16_P]
TRIG_TERM: T3.5(G) ; port TRIG_TERM
NetC40_2: C40.2 C42.2 IC14.5(VDD) L31.2
NetD1_3: D1.3(COMAC) IC17.1(R) IC17.4(D) R52.2 ; port TRIG_IO
NetR52_1: R52.1 T3.3(D)

### Layout directives
differential pair: IDX0.SIG_N, IDX0.SIG_P, IDX1.SIG_N, IDX1.SIG_P, IDX2.SIG_N, IDX2.SIG_P, IDX3.SIG_N, IDX3.SIG_P, LA16_N, LA16_P

### Notes on the sheet
- Project/Equipment
- Document
- Designer
- Drawn by
- Check.by
- Copyright WUT ISE 2018.
  This documentation describes Open Hardware and is licensed under the CERN OHL v.1.1. You may redistribute and modify this documentation under the terms of the CERN OHL v.1.1. (http://ohwr.org/CERNOHL). This documentation is distributed WITHOUT ANY EXPRESS OR IMPLIED WARRANTY, INCLUDING OF MERCHANTABILITY, SATISFACTORY QUALITY AND FITNESS FOR A PARTICULAR PURPOSE. Please see the CERN OHL v.1.1 for applicable conditions.
- Contact
- File
- Last Mod.
- Print Date
- Sheet
- Size
- A3
- of
- Rev
- (in symbol PMGD280UN, part B) 3(D); 5(G); 4(S)
- (in symbol R0201_100R_1%_0.05W_200PPM) 1%
- (in symbol R1210_270R_5%_0.5W_200PPM) 5%
- (in symbol PMGD280UN, part A) 6(D); 2(G); 1(S)

### Library data of the parts
C40 = CC0402_1UF_16V_10%_X5R: Non-polarised capacitor; Part Description: SMD Multilayer Chip Ceramic Capacitor; Manufacturer: GENERIC; Manufacturer1 Part Number: C1005X5R1C105KT; Voltage: 16V; TC: X5R; Tolerance: ±10%; Part Number: CC0402_1UF_16V_10%_X5R; Component Kind: Standard; Component Type: Standard; Pin Count: 2; Value: 1uF; Status: Preferred; Manufacturer Part Number: CC0402_1UF_16V_10%_X5R; Case: 0402; Mounted: Yes; Socket: No; SMD: Yes; Sense: No; Manufacturer1 Example: TDK; Manufacturer1 ComponentHeight: 0.55mm; HelpURL: \\cern.ch\dfs\Applications\Altium\Datasheets\CC0402_X5R_TDK_C.pdf; Author: CERN DEM JLC; CreateDate: 2012-10-25; LatestRevisionDate: 2012-10-25
C42 = CC0201_100NF_6.3V_10%_X5R: Non-polarised capacitor; Part Description: SMD Multilayer Chip Ceramic Capacitor; Manufacturer: GENERIC; Manufacturer1 Part Number: 02016D104KAT2A; Voltage: 6.3V; TC: X5R; Tolerance: ±10%; Part Number: CC0201_100NF_6.3V_10%_X5R; Component Kind: Standard; Component Type: Standard; Pin Count: 2; Value: 100nF; Status: Not Recommended; Manufacturer Part Number: CC0201_100NF_6.3V_10%_X5R; Case: 0201; Mounted: Yes; Socket: No; SMD: Yes; Sense: No; Manufacturer1 Example: AVX; Manufacturer1 ComponentHeight: 0.33mm; HelpURL: \\cern.ch\dfs\Applications\Altium\Datasheets\CC0201_X5R_AVX.pdf; Author: CERN DEM JLC; CreateDate: 03.12.2007; LatestRevisionDate: 03.12.2007
C103 = CC0201_100NF_6.3V_10%_X5R: Non-polarised capacitor; Part Description: SMD Multilayer Chip Ceramic Capacitor; Manufacturer: GENERIC; Manufacturer1 Part Number: 02016D104KAT2A; Voltage: 6.3V; TC: X5R; Tolerance: ±10%; Table: Capacitors SMD; Part Number: CC0201_100NF_6.3V_10%_X5R; Component Kind: Standard; Component Type: Standard; Pin Count: 2; Value: 100nF; Status: Not Recommended; Manufacturer Part Number: CC0201_100NF_6.3V_10%_X5R; Case: 0201; Mounted: Yes; Socket: No; SMD: Yes; Manufacturer1 Example: AVX; Manufacturer1 ComponentHeight: 0.33mm; HelpURL: \\cern.ch\dfs\Applications\Altium\Datasheets\CC0201_X5R_AVX.pdf; Author: CERN DEM JLC; CreateDate: 2007-12-03; LatestRevisionDate: 2007-12-03
C104 = CC0201_10NF_10V_10%_X5R: Non-polarised capacitor; Part Description: SMD Multilayer Chip Ceramic Capacitor; Manufacturer: GENERIC; Manufacturer1 Part Number: 0201ZD103KAT2A; Voltage: 10V; TC: X5R; Tolerance: ±10%; Table: Capacitors SMD; Part Number: CC0201_10NF_10V_10%_X5R; Component Kind: Standard; Component Type: Standard; Pin Count: 2; Value: 10nF; Status: Not Recommended; Manufacturer Part Number: CC0201_10NF_10V_10%_X5R; Case: 0201; Mounted: Yes; Socket: No; SMD: Yes; Manufacturer1 Example: AVX; Manufacturer1 ComponentHeight: 0.33mm; HelpURL: \\cern.ch\dfs\Applications\Altium\Datasheets\CC0201_X5R_AVX.pdf; Author: CERN DEM JLC; CreateDate: 2007-12-03; LatestRevisionDate: 2007-12-03
D1 = BAR66: Serial Diode; Part Description: Silicon PIN Diode Array (Series Connected); Manufacturer: INFINEON; Voltage: 150V; Power: 250mA; Table: Diodes; Part Number: BAR66; Component Kind: Standard; Component Type: Standard; Device: BAR66; PackageDescription: SOT23 3-Leads, Pitch 0.95mm - Body 1.3x2.9mm, IPC Medium Density; Manufacturer Part Number: BAR66; Pin Count: 3; Case: SOT23; Mounted: Yes; Socket: No; SMD: Yes; ComponentHeight: 1.1mm; HelpURL: \\cern.ch\dfs\Applications\Altium\Datasheets\BAR66.pdf; Author: CERN DEM JLC; CreateDate: 18/1/2010; LatestRevisionDate: 5/10/2010
IC14 = Si53340-B-GM: Low-Jitter LVDS Fanout Clock Buffers, 10-Output,  Any-Input, Any-Frequency up to 1250MHz; Manufacturer: SILICON LABS; PressFit: No; Bonding: No; Part Number: Si53340-B-GM; Component Kind: Standard; Component Type: Standard; Device: Si53340-B-GM; PackageDescription: QFN, 0.50mm Pitch, Square; 16 Pin, 3.00mm L X 3.00mm W X 0.90mm H Body (w/thermal tab 1.75mm x 1.75mm), IPC Medium Density; Part Description: Low-Jitter LVDS Fanout Clock Buffers, 10-Output,  Any-Input, Any-Frequency up to 1250MHz; Manufacturer Part Number: Si53340-B-GM; Pin Count: 17; Case: QFN16; Mounted: Yes; Socket: No; SMD: Yes; Sense: No; ComponentHeight: 0.9mm; HelpURL: \\cern.ch\dfs\Applications\Altium\Datasheets\Si53340-B-GM.pdf; Author: CERN DEM MR; CreateDate: 04.09.2017; LatestRevisionDate: 04.09.2017
IC17 = SN65LVDM176: High Speed Differential Transceiver LVDS/LVTTL; ComponentLink1Description: Datasheet; ComponentLink1URL: C:\TSR\Laurin\Projects\FMC\CERN DAC\Parts\Digital\SN65LVDM176.pdf
L31 = IND0402_MURATA_BLM15HD601SN1: Part Description: SMD EMIFIL Suppression Chip Ferrite Bead; Manufacturer: MURATA; Manufacturer Part Number: BLM15HD601SN1D; Power: 300mA; Resistance: 0.85R; Tolerance: ±25%; Part Number: IND0402_MURATA_BLM15HD601SN1; Component Kind: Standard; Component Type: Standard; Pin Count: 2; Value: 600R@100MHz; Status: None; Case: 0402; Mounted: Yes; Socket: No; SMD: Yes; Sense: No; ComponentHeight: 0.55mm; HelpURL: \\cern.ch\dfs\Applications\Altium\Datasheets\IND0402_MURATA_BLM15H.pdf; Author: CERN DEM JLC; CreateDate: 28.02.2012; LatestRevisionDate: 25.10.2018
R50 R75 = R0201_100R_1%_0.05W_200PPM: Resistor - 1%; Part Description: Thick Film Chip Resistor; Manufacturer: GENERIC; Manufacturer1 Part Number: CRCW0201100RFNED; Power: 0.05W; TC: ±200ppm/°C; PressFit: No; Part Number: R0201_100R_1%_0.05W_200PPM; Component Kind: Standard; Component Type: Standard; Pin Count: 2; Value: 100; Status: Not Recommended; Tolerance: ±1%; Manufacturer Part Number: R0201_100R_1%_0.05W_200PPM; Case: 0201; Mounted: Yes; Socket: No; SMD: Yes; Manufacturer1 Example: VISHAY; Manufacturer1 ComponentHeight: 0.27mm; HelpURL: \\cern.ch\dfs\Applications\Altium\Datasheets\R0201_VISHAY_CRCW0201 e3.pdf; Author: CERN DEM JLC; CreateDate: 13.11.2014; LatestRevisionDate: 13.11.2014; Sense: No
R52 = R1210_270R_5%_0.5W_200PPM: Resistor - 5%; Part Number: R1210_49R9_1%_0.33W_100PPM; Part Description: General Purpose Thick Film Chip Resistor; Manufacturer: VISHAY; Manufacturer Part Number: CRCW121049R9FK; Power: 0.33W; TC: ±100ppm/°C; Table: Resistors SMD; Component Kind: Standard; Component Type: Standard; Pin Count: 2; Value: 49R9; Status: None; Tolerance: ±5%; Case: 1210; Mounted: Yes; Socket: No; SMD: Yes; ComponentHeight: 0.7mm; HelpURL: \\cern.ch\dfs\Applications\Altium\Datasheets\R1210_PANASONIC_ERJ.pdf; Author: CERN DEM JLC; CreateDate: 2011-10-26; LatestRevisionDate: 2011-10-26
T3 = PMGD280UN: Dual N-Channel micro TrenchMOS™ Ultra Low Level FET; Part Description: 20V 870mA Dual N-Channel micro TrenchMOS™ Ultra Low Level FET; Manufacturer: NXP SEMICONDUCTORS; PressFit: No; Bonding: No; Part Number: PMGD280UN; Component Kind: Standard; Component Type: Standard; Device: PMGD280UN; PackageDescription: SOT363, SC70-6, SOT, 0.65mm Pitch, 6 pin, 1.25mm W X 2.00mm L X 1.10mm H, IPC Medium Density; Manufacturer Part Number: PMGD280UN; Pin Count: 6; Case: SOT363; Mounted: Yes; Socket: No; SMD: Yes; Sense: No; ComponentHeight: 1.1mm; HelpURL: \\cern.ch\dfs\Applications\Altium\Datasheets\PMGD280UN.pdf; Author: CERN DEM JLC; CreateDate: 19.11.2014; LatestRevisionDate: 19.11.2014